# Altium schematic sheet 10_Clock.SchDoc: Clock
size A3; Organization: Lime Microsystems; Address1: Surrey Tech Centre; Address2: Guildford GU2 7YG; Address3: Surrey; Address4: United Kingdom; Revision: v1.0; SheetNumber: 10; SheetTotal: 11
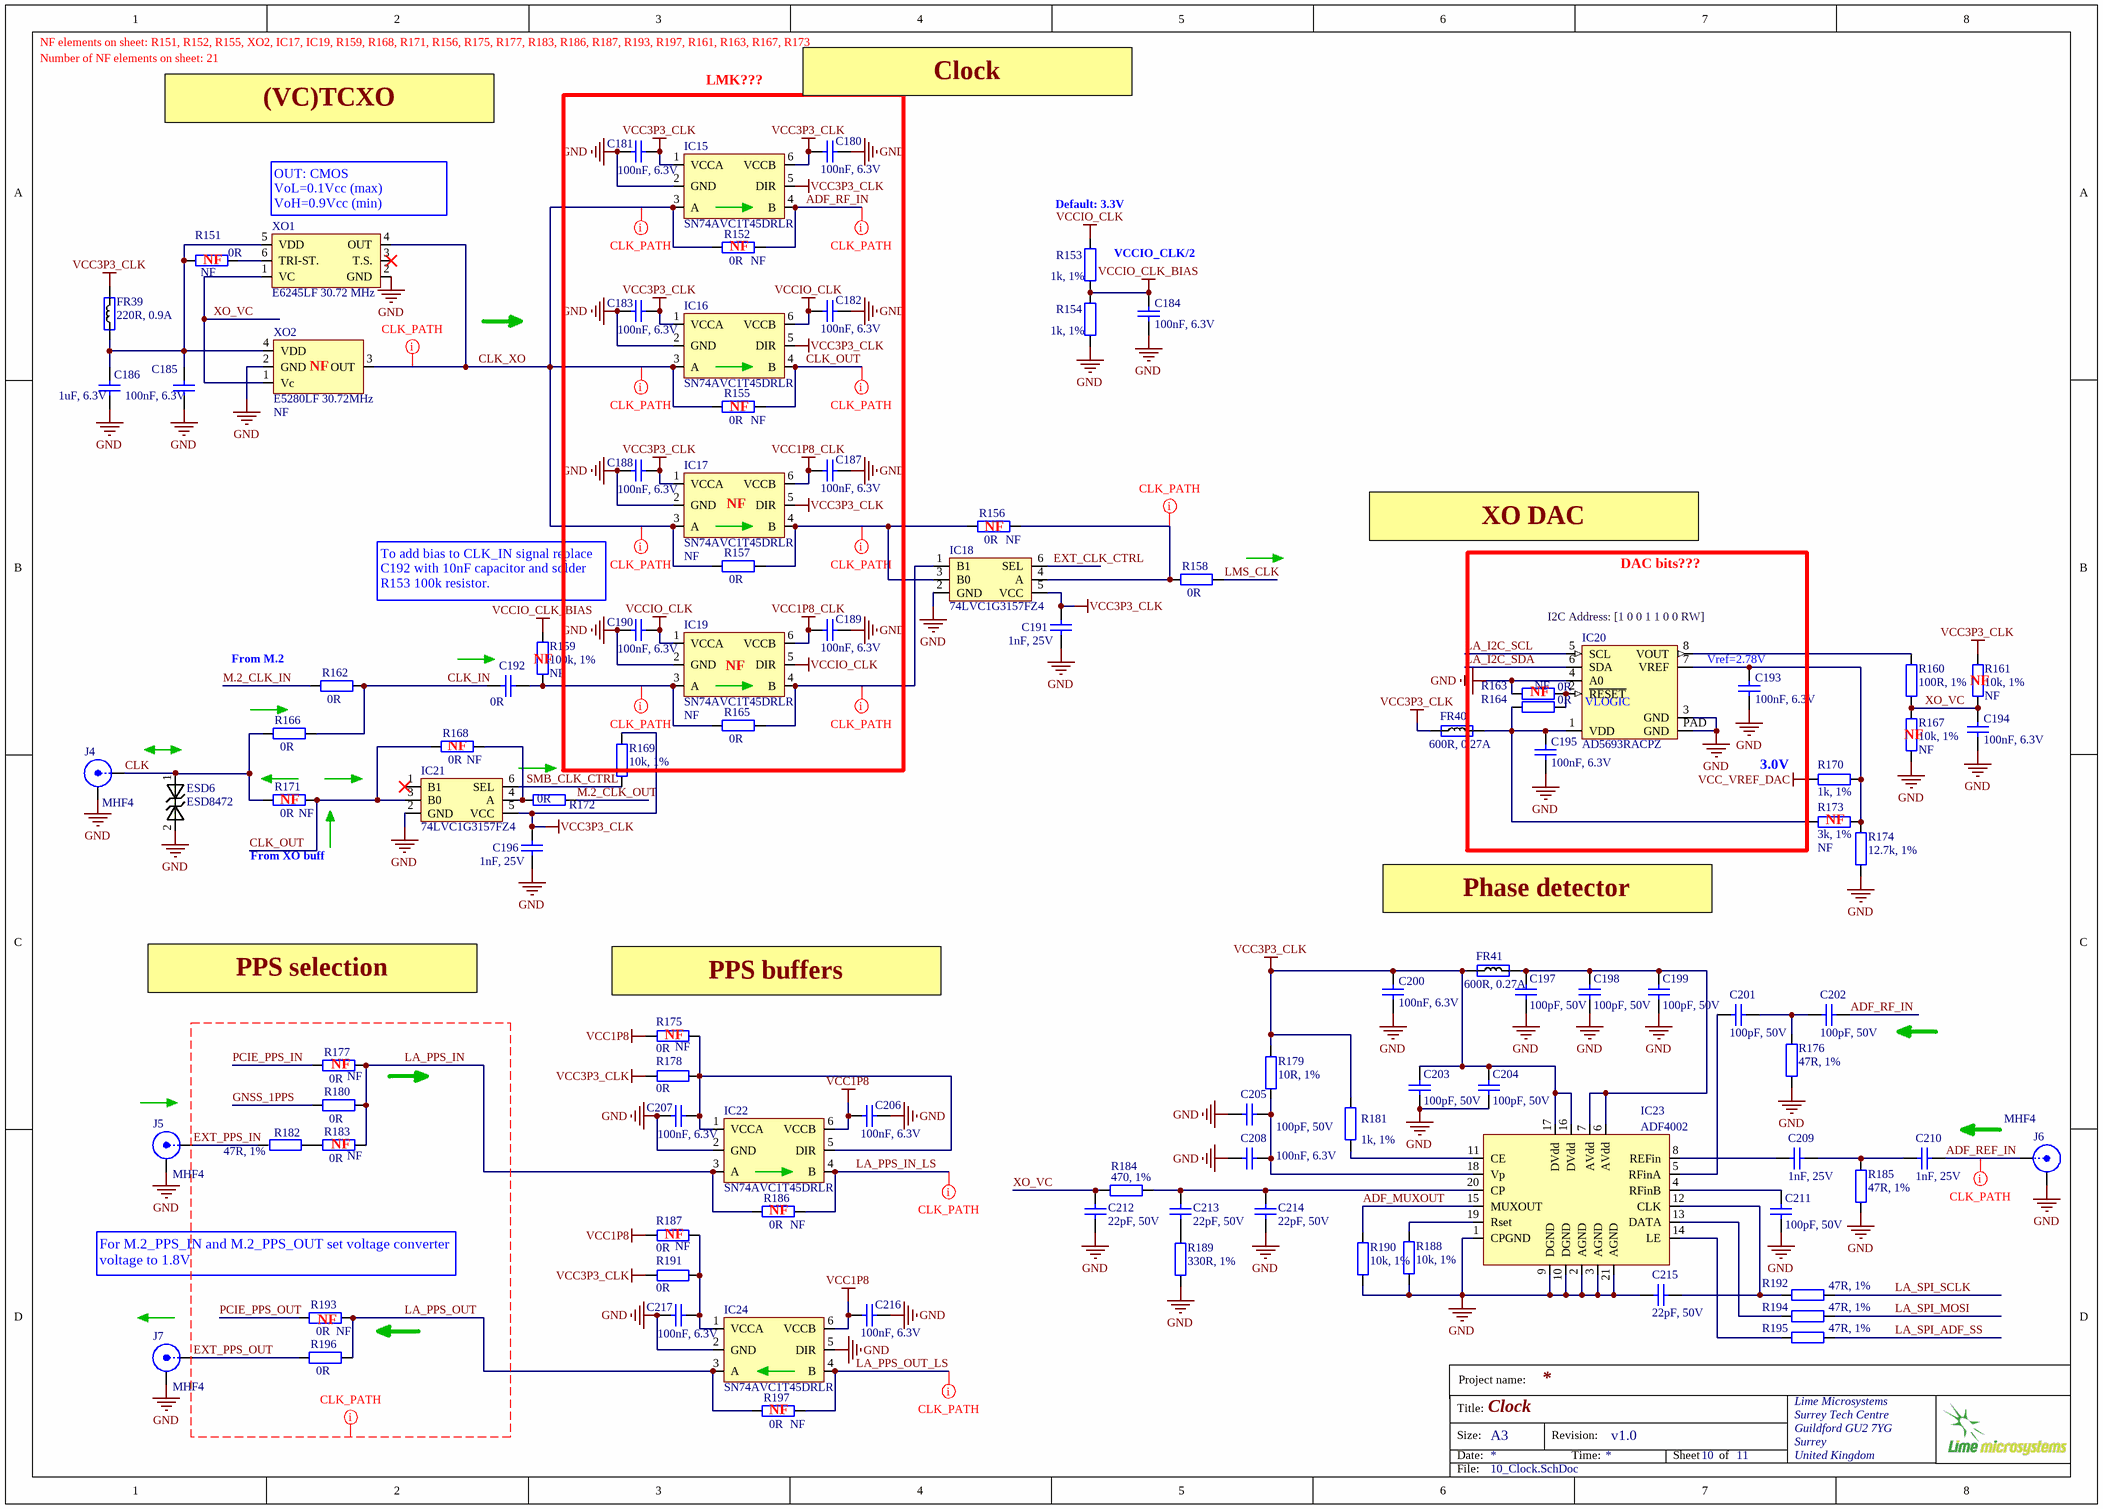
[diagram p0: 10_Clock.SchDoc]

## Parts
C180  100nF, 6.3V  [CAP0201]
C181  100nF, 6.3V  [CAP0201]
C182  100nF, 6.3V  [CAP0201]
C183  100nF, 6.3V  [CAP0201]
C184  100nF, 6.3V  [CAP0201]
C185  100nF, 6.3V  [CAP0201]
C186  1uF, 6.3V  [CAP0201]
C187  100nF, 6.3V  [CAP0201]
C188  100nF, 6.3V  [CAP0201]
C189  100nF, 6.3V  [CAP0201]
C190  100nF, 6.3V  [CAP0201]
C191  1nF, 25V  [CAP0201]
C192  0R  [CAP0201]
C193  100nF, 6.3V  [CAP0201]
C194  100nF, 6.3V  [CAP0201]
C195  100nF, 6.3V  [CAP0201]
C196  1nF, 25V  [CAP0201]
C197  100pF, 50V  [CAP0201]
C198  100pF, 50V  [CAP0201]
C199  100pF, 50V  [CAP0201]
C200  100nF, 6.3V  [CAP0201]
C201  100pF, 50V  [CAP0201]
C202  100pF, 50V  [CAP0201]
C203  100pF, 50V  [CAP0201]
C204  100pF, 50V  [CAP0201]
C205  100pF, 50V  [CAP0201]
C206  100nF, 6.3V  [CAP0201]
C207  100nF, 6.3V  [CAP0201]
C208  100nF, 6.3V  [CAP0201]
C209  1nF, 25V  [CAP0201]
C210  1nF, 25V  [CAP0201]
C211  100pF, 50V  [CAP0201]
C212  22pF, 50V  [CAP0201]
C213  22pF, 50V  [CAP0201]
C214  22pF, 50V  [CAP0201]
C215  22pF, 50V  [CAP0201]
C216  100nF, 6.3V  [CAP0201]
C217  100nF, 6.3V  [CAP0201]
ESD6  ESD8472  [ESD8472_X3DFN2]
FR39  220R, 0.9A  [RES0402]
FR40  600R, 0.27A  [RES0201]
FR41  600R, 0.27A  [RES0201]
IC15  SN74AVC1T45DRLR  [SN74AVC1T45DRLR_SOT-5X3]
IC16  SN74AVC1T45DRLR  [SN74AVC1T45DRLR_SOT-5X3]
IC17  SN74AVC1T45DRLR  Assembly Info: NF  [SN74AVC1T45DRLR_SOT-5X3]
IC18  74LVC1G3157FZ4  [74LVC1G3157FZ4_SPDT_SW_DFN1410-6]
IC19  SN74AVC1T45DRLR  Assembly Info: NF  [SN74AVC1T45DRLR_SOT-5X3]
IC20  AD5693RACPZ  [AD5693RACPZ-1RL7_DAC_8LFCSP]
IC21  74LVC1G3157FZ4  [74LVC1G3157FZ4_SPDT_SW_DFN1410-6]
IC22  SN74AVC1T45DRLR  [SN74AVC1T45DRLR_SOT-5X3]
IC23  ADF4002  [ADF4002]
IC24  SN74AVC1T45DRLR  [SN74AVC1T45DRLR_SOT-5X3]
J4  MHF4  [IPEX_MHF4_conn]
J5  MHF4  [IPEX_MHF4_conn]
J6  MHF4  [IPEX_MHF4_conn]
J7  MHF4  [IPEX_MHF4_conn]
R151  0R  Assembly Info: NF  [RES0402]
R152  0R  Assembly Info: NF  [RES0201]
R153  1k, 1%  [RES0201]
R154  1k, 1%  [RES0201]
R155  0R  Assembly Info: NF  [RES0201]
R156  0R  Assembly Info: NF  [RES0201]
R157  0R  [RES0201]
R158  0R  [RES0201]
R159  100k, 1%  Assembly Info: NF  [RES0201]
R160  100R, 1%  [RES0201]
R161  10k, 1%  Assembly Info: NF  [RES0201]
R162  0R  [RES0201]
R163  0R  Assembly Info: NF  [RES0201]
R164  0R  [RES0201]
R165  0R  [RES0201]
R166  0R  [RES0201]
R167  10k, 1%  Assembly Info: NF  [RES0201]
R168  0R  Assembly Info: NF  [RES0201]
R169  10k, 1%  [RES0201]
R170  1k, 1%  [RES0201]
R171  0R  Assembly Info: NF  [RES0201]
R172  0R  [RES0201]
R173  3k, 1%  Assembly Info: NF  [RES0201]
R174  12.7k, 1%  [RES0201]
R175  0R  Assembly Info: NF  [RES0201]
R176  47R, 1%  [RES0201]
R177  0R  Assembly Info: NF  [RES0201]
R178  0R  [RES0201]
R179  10R, 1%  [RES0201]
R180  0R  [RES0201]
R181  1k, 1%  [RES0201]
R182  47R, 1%  [RES0201]
R183  0R  Assembly Info: NF  [RES0201]
R184  470, 1%  [RES0201]
R185  47R, 1%  [RES0201]
R186  0R  Assembly Info: NF  [RES0201]
R187  0R  Assembly Info: NF  [RES0201]
R188  10k, 1%  [RES0201]
R189  330R, 1%  [RES0201]
R190  10k, 1%  [RES0201]
R191  0R  [RES0201]
R192  47R, 1%  [RES0201]
R193  0R  Assembly Info: NF  [RES0201]
R194  47R, 1%  [RES0201]
R195  47R, 1%  [RES0201]
R196  0R  [RES0201]
R197  0R  Assembly Info: NF  [RES0201]
XO1  E6245LF 30.72 MHz  [RAKON_RPT7050A]
XO2  E5280LF 30.72MHz  Assembly Info: NF  [RAKON_TXCO]

## Nets
GND: C180.2 C181.1 C182.2 C183.1 C184.2 C185.2 C186.2 C187.2 C188.1 C189.2 C190.1 C191.1 C193.2 C194.2 C195.2 C196.1 C197.1 C198.1 C199.1 C200.2 C203.1 C204.1 C205.2 C206.2 C207.1 C208.1 C211.1 C212.1 C214.1 C215.2 C216.2 C217.1 ESD6.2 IC15.2(GND) IC16.2(GND) IC17.2(GND) IC18.2(GND) IC19.2(GND) IC20.3(GND) IC20.4(A0) IC20.PAD(GND) IC21.2(GND) IC22.2(GND) IC23.1(CPGND) IC23.2(AGND) IC23.3(AGND) IC23.9(DGND) IC23.10(DGND) IC23.21(AGND) IC24.2(GND) IC24.5(DIR) J4.2(Y) J5.2(Y) J6.2(Y) J7.2(Y) R154.2 R163.1 R167.2 R174.2 R176.2 R185.1 R188.2 R189.2 R190.2 XO1.2(GND) XO2.2(GND)
VCC1P8: C206.1 C216.1 IC22.6(VCCB) IC24.6(VCCB) R175.2 R187.2
VCC1P8_CLK: C187.1 C189.1 IC17.6(VCCB) IC19.6(VCCB)
VCC3P3_CLK: C180.1 C181.2 C183.2 C188.2 C191.2 C196.2 C200.1 C203.2 C204.2 FR39.2 FR40.1 FR41.1 IC15.1(VCCA) IC15.5(DIR) IC15.6(VCCB) IC16.1(VCCA) IC16.5(DIR) IC17.1(VCCA) IC17.5(DIR) IC18.5(VCC) IC21.5(VCC) IC23.16(DVdd) IC23.17(DVdd) R161.1 R169.2 R178.2 R179.2 R181.1 R191.2
VCC_VREF_DAC: R170.2
VCCIO_CLK: C182.1 C190.2 IC16.6(VCCB) IC19.1(VCCA) IC19.5(DIR) R153.1
VCCIO_CLK_BIAS: C184.1 R153.2 R154.1 R159.1
ADF_MUXOUT: IC23.15(MUXOUT) R190.1
ADF_REF_IN: C210.2 J6.1(X)
ADF_RF_IN: C202.1 IC15.4(B) R152.2
CLK: ESD6.1 J4.1(X) R166.1 R171.1
CLK_IN: C192.1 R162.2 R166.2
CLK_OUT: IC16.4(B) IC21.3(B0) R155.2 R168.1 R171.2
CLK_XO: IC15.3(A) IC16.3(A) IC17.3(A) R152.1 R155.1 R157.1 XO1.4(OUT) XO2.3(OUT)
EXT_CLK_CTRL: IC18.6(SEL)
EXT_PPS_IN: J5.1(X) R182.2
EXT_PPS_OUT: J7.1(X) R196.1
GNSS_1PPS: R180.1
LA_I2C_SCL: IC20.5(SCL)
LA_I2C_SDA: IC20.6(SDA)
LA_PPS_IN: IC22.3(A) R177.2 R180.2 R183.2 R186.1
LA_PPS_IN_LS: IC22.4(B) R186.2
LA_PPS_OUT: IC24.3(A) R193.2 R196.2 R197.1
LA_PPS_OUT_LS: IC24.4(B) R197.2
LA_SPI_ADF_SS: R195.2
LA_SPI_MOSI: R194.2
LA_SPI_SCLK: R192.2
LMS_CLK: R158.2
M.2_CLK_IN: R162.1
M.2_CLK_OUT: R172.2
PCIE_PPS_IN: R177.1
PCIE_PPS_OUT: R193.1
SMB_CLK_CTRL: IC21.6(SEL) R169.1
XO_VC: C194.1 C212.2 R160.2 R161.2 R167.1 R184.1 XO1.1(VC) XO2.1(Vc)
NetC185_1: C185.1 C186.1 FR39.1 R151.2 XO1.5(VDD) XO2.4(VDD)
NetC192_2: C192.2 IC19.3(A) R159.2 R165.1
NetC193_1: C193.1 IC20.7(VREF) R170.1 R173.1 R174.1
NetC195_1: C195.1 FR40.2 IC20.1(VDD) R164.1 R173.2
NetC197_2: C197.2 C198.2 C199.2 FR41.2 IC23.6(AVdd) IC23.7(AVdd)
NetC201_1: C201.1 C202.2 R176.1
NetC201_2: C201.2 IC23.5(RFinA)
NetC205_1: C205.1 C208.2 IC23.18(Vp) R179.1
NetC207_2: C207.2 IC22.1(VCCA) IC22.5(DIR) R175.1 R178.1
NetC209_1: C209.1 IC23.8(REFin)
NetC209_2: C209.2 C210.1 R185.2
NetC211_2: C211.2 IC23.4(RFinB)
NetC213_1: C213.1 R189.1
NetC213_2: C213.2 C214.2 IC23.20(CP) R184.2
NetC215_1: C215.1 IC23.12(CLK) R192.1
NetC217_2: C217.2 IC24.1(VCCA) R187.1 R191.1
NetIC17_4: IC17.4(B) IC18.3(B0) R156.1 R157.2
NetIC18_1: IC18.1(B1) IC19.4(B) R165.2
NetIC18_4: IC18.4(A) R156.2 R158.1
NetIC20_2: IC20.2(~{RESET}) R163.2 R164.2
NetIC20_8: IC20.8(VOUT) R160.1
NetIC21_4: IC21.4(A) R168.2 R172.1
NetIC23_11: IC23.11(CE) R181.2
NetIC23_13: IC23.13(DATA) R194.1
NetIC23_14: IC23.14(LE) R195.1
NetIC23_19: IC23.19(Rset) R188.1
NetR151_1: R151.1 XO1.6(TRI-ST.)
NetR182_1: R182.1 R183.1

Not connected (* = marked no-connect by the designer): IC21 1(B1)*; XO1 3(T.S.)*

## Layout directives
net class CLK_PATH: ADF_REF_IN, ADF_RF_IN, CLK_OUT, CLK_XO, EXT_PPS_IN, EXT_PPS_OUT, GNSS_1PPS, LA_PPS_IN, LA_PPS_IN_LS, LA_PPS_OUT, LA_PPS_OUT_LS, NetC192_2, NetIC17_4, NetIC18_1, NetIC18_4, PCIE_PPS_IN, PCIE_PPS_OUT

## Notes on the sheet
- NF elements on sheet: R151, R152, R155, XO2, IC17, IC19, R159, R168, R171, R156, R175, R177, R183, R186, R187, R193, R197, R161, R163, R167, R173
- Number of NF elements on sheet: 21
- LMK???
- Clock
- (VC)TCXO
- (near XO1) OUT: CMOS
  VoL=0.1Vcc (max)
  VoH=0.9Vcc (min)
- (near R152) NF
- (near R153) Default: 3.3V
- (near R151) NF
- (near R153) VCCIO_CLK/2
- (near XO2) NF
- (near R155) NF
- (near IC17) NF
- (near R156) NF
- XO DAC
- DAC bits???
- To add bias to CLK_IN signal replace C192 with 10nF capacitor and solder R153 100k resistor.
- (near IC20) I2C Address: [1 0 0 1 1 0 0 RW]
- From M.2
- (near R159) NF
- (near IC19) NF
- (near R163) NF
- (near IC20) VLOGIC
- (near C193) Vref=2.78V
- (near R161) NF
- (near R168) NF
- (near R170) 3.0V
- (near R167) NF
- (near R171) NF
- (near R173) NF
- (near R171) From XO buff
- Phase detector
- PPS selection
- (near R175) PPS buffers
- (near R175) NF
- (near R177) NF
- (near R183) NF
- (near R187) NF
- (near R186) NF
- (near R193) For M.2_PPS_IN and M.2_PPS_OUT set voltage converter voltage to 1.8V
- (near R193) NF
- (near R197) NF
- Project name:
- Title:
- Size:
- Date:
- A3
- Revision:
- Time:
- Sheet
- of
- File:

## Library data of the parts
C180-C185 C187-C190 C193-C195 C200 C206-C208 C216 C217 = Cap_0402: Part Description: 0.1 µF ±20% 10V Ceramic Capacitor X5R 0201 (0603 Metric); Manufacturer: Samsung; Manufacturer Part Number 1: CL03A104MP3NNNC; Tolerance: 20%; Voltage Rating (DC): 10V; Value: 100nF, 6.3V; Capacitance: 100nF; Case/Package: 0201; Case Code (Imperial): 0201; Case Code (Metric): 0603; ComponentLink5Description: https://datasheet.ciiva.com/25788/cl03a104mp3nnnc-25788272.pdf?src-supplier=Digi-Key; ComponentLink5URL: https://datasheet.ciiva.com/25788/cl03a104mp3nnnc-25788272.pdf?src-supplier=Digi-Key; Length: 0.024inch; Max Operating Temperature: 85°C; Min Operating Temperature: -55°C; Mount: Surface Mount; Package Quantity: 1; Packaging: Tape and Reel; Pricing 1: 1=0,10000, 10=0,03000, 50=0,01640, 100=0,01330, 500=0,00950, 1000=0,00747, 2500=0,00679, 5000=0,00625 (USD); RoHS: Yes; RoHS Compliant: Yes; Series: CL; Stock 1: 3817176; Supplier 1: Digi-Key; Supplier Part Number 1: 1276-1321-1-ND; Thickness: 0.013inch; Voltage Rating: 10V; Width: 0.012inch
C186 = Cap_0402: Manufacturer: TDK Corporation; Manufacturer Part Number 1: JMK063ABJ105MP-F; Part Description: 1µF ±20% 6.3V X5R Ceramic Capacitor -55°C ~ 85°C Surface Mount, MLCC 0201 (0603 Metric) 0.024" L x 0.012" W (0.60mm x 0.30mm); Value: 1uF, 20%; Tolerance: ±20%; Capacitance: 1.0µF; Temperature Coefficient: X5R; Supplier 1: Digi-Key; Supplier Part Number 1: 587-5864-2-ND; Applications: General Purpose; Features: -; Lead Style: -; Ratings: -; Thickness (Max): -; Lead Spacing: -; Height - Seated (Max): -; Size / Dimension: 0.024" L x 0.012" W (0.60mm x 0.30mm); Mounting Type: Surface Mount, MLCC; Operating Temperature: -55°C ~ 85°C; Package / Case: 0201 (0603 Metric); Packaging: Cut Tape (CT); Voltage - Rated: 6.3V; Category: Capacitors; RoHS: RoHS Compliant
C191 C196 C209 C210 = Cap_0402: Manufacturer Part Number 1: C0603X7R1E102K030BA; Manufacturer: TDK Corporation; Part Description: 1000pF ±10% 25V X7R Ceramic Capacitor -55°C ~ 125°C Surface Mount, MLCC 0201 (0603 Metric) 0.024" L x 0.012" W (0.60mm x 0.30mm); Temperature Coefficient: X7R; Tolerance: ±10%; Capacitance: 1000pF; Value: 1nF, 25V; Supplier 1: Digi-Key; Supplier Part Number 1: 445-7275-1-ND; Voltage - Rated: 25V; Features: -; Package / Case: 0201 (0603 Metric); Lead Spacing: -; Mounting Type: Surface Mount, MLCC; Lead Style: -; Height - Seated (Max): -; Operating Temperature: -55°C ~ 125°C; Size / Dimension: 0.024" L x 0.012" W (0.60mm x 0.30mm); Applications: General Purpose; Ratings: -; Thickness (Max): 0.013" (0.33mm); RoHS: RoHS Compliant; Packaging: Cut Tape (CT); Category: Capacitors
C192 = Cap_0402: Manufacturer: Yageo; Manufacturer Part Number 1: RC0201JR-070RL; Part Description: 0 Ohms Jumper Chip Resistor 0201 (0603 Metric) Moisture Resistant Thick Film; Max Power Dissipation: 50mW; Resistance Tolerance: 5%; Voltage Rating (DC): 25V; Case/Package: 0201; Case Code (Imperial): 0201; Case Code (Metric): 0603; ComponentLink1Description: http://www.yageo.com/documents/recent/PYu-RC_Group_51_RoHS_L_7.pdf; ComponentLink1URL: http://www.yageo.com/documents/recent/PYu-RC_Group_51_RoHS_L_7.pdf; ComponentLink2Description: https://datasheet.ciiva.com/7672/1563626-7672248.pdf?src-supplier=Element14; ComponentLink2URL: https://datasheet.ciiva.com/7672/1563626-7672248.pdf?src-supplier=Element14; ComponentLink3Description: https://datasheet.ciiva.com/7672/1563626-7672247.pdf?src-supplier=Element14; ComponentLink3URL: https://datasheet.ciiva.com/7672/1563626-7672247.pdf?src-supplier=Element14; ComponentLink4Description: https://datasheet.ciiva.com/7660/1421516-7660808.pdf?src-supplier=Element14; ComponentLink4URL: https://datasheet.ciiva.com/7660/1421516-7660808.pdf?src-supplier=Element14; ComponentLink5Description: https://datasheet.ciiva.com/46391/1421516-46391340.pdf?src-supplier=Element14; ComponentLink5URL: https://datasheet.ciiva.com/46391/1421516-46391340.pdf?src-supplier=Element14; Construction: Rectangular; Contact Plating: Tin,Matte; Depth: 0.3mm; Features: Moisture Resistant; Height: 0.01inch; Lead Free: Lead Free; Length: 0.024inch; Max Operating Temperature: 125°C; Military Standard: Not; Min Operating Temperature: -55°C; Number of Terminations: 2; Package Quantity: 1; Packaging: Tape and Reel; Power Rating: 50mW; Pricing 1: 1=0,10000, 10=0,03700, 25=0,02680, 50=0,02020, 100=0,01500, 250=0,01140, 500=0,00912, 1000=0,00672, 5000=0,00482 (USD); Radiation Hardening: No; Resistance: 0R; Resistor Type: Thick Film; RoHS: Yes; RoHS Compliant: Yes; Series: RC; Size Code: 0201; Stock 1: 6252381; Supplier 1: Digi-Key; Supplier Part Number 1: 311-0.0NCT-ND; Termination: SMD/SMT; Tolerance: 5%; Value: 0R; Voltage Rating: 25V; Weight: 6E-06oz; Width: 0.012inch
C197-C199 C201-C205 C211 = Cap_0402: Part Description: 100 pF ±5% 50V Ceramic Capacitor C0G, NP0 0201 (0603 Metric); Manufacturer: TDK; Manufacturer Part Number 1: C0603C0G1H101J030BA; Dielectric: C0G; Dielectric Material: Ceramic; Insulation Resistance: 10GR; Tolerance: 5%; Value: 100pF, 50V; Capacitance: 100pF; Case/Package: 0201; Case Code (Imperial): 0201; Case Code (Metric): 0603; ComponentLink1Description: https://datasheet.ciiva.com/24217/c0603c0g1h101j030ba-264106-24217425.pdf?src-supplier=Mouser; ComponentLink1URL: https://datasheet.ciiva.com/24217/c0603c0g1h101j030ba-264106-24217425.pdf?src-supplier=Mouser; ComponentLink2Description: https://datasheet.ciiva.com/16205/mlcc-commercial-general-en-16205590.pdf?src-supplier=Future+Electronics; ComponentLink2URL: https://datasheet.ciiva.com/16205/mlcc-commercial-general-en-16205590.pdf?src-supplier=Future+Electronics; ComponentLink3Description: https://datasheet.ciiva.com/6250/tdkmlcccaprange-6250351.pdf?src-supplier=Digi-Key; ComponentLink3URL: https://datasheet.ciiva.com/6250/tdkmlcccaprange-6250351.pdf?src-supplier=Digi-Key; Construction: Flat; Depth: 0.3mm; Height: 0.3mm; Lead Free: Lead Free; Length: 0.6mm; Max Operating Temperature: 125°C; Min Operating Temperature: -55°C; Mount: Surface Mount; Number of Pins: 2; Package Quantity: 1; Packaging: Tape and Reel; Pricing 1: 1=0,10000, 10=0,06000, 50=0,03280, 100=0,02670, 500=0,01908, 1000=0,01500, 2500=0,01364, 5000=0,01254 (USD); Reach SVHC Compliant: Yes; RoHS: Yes; RoHS Compliant: Yes; Series: C; Stock 1: 367528; Supplier 1: Digi-Key; Supplier Part Number 1: 445-1786-1-ND; Termination: SMD/SMT; Thickness: 0.013inch; Voltage: 50V; Voltage Rating (DC): 50V; Voltage Rating: 50V; Weight: 6E-06oz; Width: 0.012inch
C212-C215 = Cap_0402: Manufacturer: Murata; Manufacturer Part Number 1: GRM0335C1H220JA01D; Part Description: 22 pF ±5% 50V Ceramic Capacitor C0G, NP0 0201 (0603 Metric); Tolerance: 5%; Dielectric: C0G; Value: 22pF, 50V; Supplier 1: Digi-Key; Supplier Part Number 1: 490-6123-1-ND; Stock 1: 2966748; Pricing 1: 1=0,10000, 10=0,01300, 50=0,00720, 100=0,00590, 500=0,00424, 1000=0,00333, 2500=0,00303, 5000=0,00279 (USD); RoHS: Yes; Mount: Surface Mount; Case/Package: 0201; Case Code (Metric): 0603; Case Code (Imperial): 0201; Min Operating Temperature: -55°C; Max Operating Temperature: 125°C; Package Quantity: 15000; Capacitance: 22pF; Voltage Rating: 50V; Packaging: Tape and Reel; Termination: SMD/SMT; Voltage: 50V; Voltage Rating (DC): 50V; Series: GRM; Length: 0.6mm; Width: 0.012inch; Height: 0.3mm; Thickness: 0.013inch; Depth: 0.3mm; Lead Free: Lead Free; RoHS Compliant: Yes; ComponentLink1URL: https://datasheet.ciiva.com/6271/partnumbering-e-01-6271146.pdf?src-supplier=Digi-Key; ComponentLink1Description: https://datasheet.ciiva.com/6271/partnumbering-e-01-6271146.pdf?src-supplier=Digi-Key; ComponentLink2URL: https://datasheet.ciiva.com/6271/partnumbering-e-01-6271143.pdf?src-supplier=Digi-Key; ComponentLink2Description: https://datasheet.ciiva.com/6271/partnumbering-e-01-6271143.pdf?src-supplier=Digi-Key; ComponentLink3URL: https://datasheet.ciiva.com/6271/partnumbering-e-01-6271149.pdf?src-supplier=Digi-Key; ComponentLink3Description: https://datasheet.ciiva.com/6271/partnumbering-e-01-6271149.pdf?src-supplier=Digi-Key
ESD6 = ESD8472: Manufacturer: ON Semiconductor; Manufacturer Part Number 1: ESD8472MUT5G; Part Description: TVS DIODE 5.3VWM 14VC X3DFN2; Voltage - Reverse Standoff (Typ): 5.3V (Max); Voltage - Breakdown (Min): 7V; Voltage - Clamping (Max) @ Ipp: 14V; Current - Peak Pulse (10/1000µs): 3A (8/20µs); Power Line Protection: No; Capacitance @ Frequency: 0.2pF @ 1MHz; Supplier 1: Digi-Key; RoHS: RoHS Compliant; Category: Circuit Protection; Stock 1: 2295; Pricing 1: 1=0.39, 10=0.315, 100=0.2142, 500=0.16068, 1000=0.12051 (USD); Packaging: Cut Tape (CT); Part Status: Active; Type: Zener; Power - Peak Pulse: -; Applications: Automotive, RF Antenna; Operating Temperature: -55°C ~ 150°C (TJ); Mounting Type: Surface Mount; Package / Case: 2-XFDFN; Supplier Device Package: 2-X3DFN (0.62x0.32); ComponentLink1URL: http://www.onsemi.com/pub/Collateral/ESD8472-D.PDF; ComponentLink1Description: http://www.onsemi.com/pub/Collateral/ESD8472-D.PDF; Supplier Part Number 1: ESD8472MUT5GOSCT-ND
FR39 = Ferrite: Manufacturer: TDK Corporation; Manufacturer Part Number 1: MPZ1005S221ET000; Part Description: FERRITE BEAD 220 OHM 0402 1LN; Impedance @ Frequency: 220 Ohm @ 100MHz; Current Rating: 900mA; DC Resistance (DCR): 220 mOhm Max; Supplier 1: Digi-Key; Package / Case: 0402 (1005 Metric); Category: Filters; Supplier Part Number 1: 445-9329-2-ND; Value: 220R, 0.9A
FR40 FR41 = Ferrite: Manufacturer Part Number 1: BK0603TS601-T; Manufacturer: Taiyo Yuden; Part Description: FERRITE BEAD 600 OHM 0201 1LN; DC Resistance (DCR): 750 mOhm Max; Filter Type: Differential Mode - Single; Impedance @ Frequency: 600 Ohm @ 100MHz; Current Rating: 270mA; Value: 600R@100MHz; Supplier 1: Digi-Key; Supplier Part Number 1: 587-3277-1-ND; Size / Dimension: 0.024" L x 0.012" W (0.60mm x 0.30mm); Package / Case: 0201 (0603 Metric); Height (Max): 0.013" (0.33mm); Mounting Type: Surface Mount; Packaging: Cut Tape (CT); RoHS: RoHS Compliant; Category: Filters
IC15-IC17 IC19 IC22 IC24 = SN74AVC1T45DRLR_lvl_translator: Part Description: Voltage Level Translator Bidirectional 1 Circuit 1 Channel 500Mbps SOT-5X3; Manufacturer: Texas Instruments; Supplier 1: Digi-Key; Supplier Part Number 1: 296-21022-1-ND; Manufacturer Part Number 1: SN74AVC1T45DRLR; Stock 1: 46610; Pricing 1: 1=0,68, 10=0,6, 25=0,5636, 100=0,46, 250=0,42724, 500=0,3636, 1000=0,29088 (USD); RoHS: Yes; Length: 1.6mm; Width: 1.2mm; Height: 600um; Thickness: 550um; ComponentLink1URL: https://datasheet.ciiva.com/1629/sn74avc1t45-1629536.pdf?src-supplier=Newark; ComponentLink1Description: https://datasheet.ciiva.com/1629/sn74avc1t45-1629536.pdf?src-supplier=Newark; ComponentLink2URL: https://datasheet.ciiva.com/15086/getdatasheetpartid-223729-15086386.pdf?src-supplier=Verical; ComponentLink2Description: https://datasheet.ciiva.com/15086/getdatasheetpartid-223729-15086386.pdf?src-supplier=Verical; ComponentLink3URL: https://datasheet.ciiva.com/14287/sn74avc1t45-14287328.pdf?src-supplier=Avnet; ComponentLink3Description: https://datasheet.ciiva.com/14287/sn74avc1t45-14287328.pdf?src-supplier=Avnet; ComponentLink4URL: https://datasheet.ciiva.com/22729/1862374-22729941.pdf?src-supplier=Element14; ComponentLink4Description: https://datasheet.ciiva.com/22729/1862374-22729941.pdf?src-supplier=Element14; ComponentLink5URL: https://datasheet.ciiva.com/46385/1887534-46385799.pdf?src-supplier=Element14; ComponentLink5Description: https://datasheet.ciiva.com/46385/1887534-46385799.pdf?src-supplier=Element14; ComponentLink6URL: https://datasheet.ciiva.com/14287/sn74avc1t45-14287479.pdf?src-supplier=Avnet; ComponentLink6Description: https://datasheet.ciiva.com/14287/sn74avc1t45-14287479.pdf?src-supplier=Avnet; ComponentLink7URL: https://datasheet.ciiva.com/1899/sn74avc1t45-1899278.pdf?src-supplier=Digi-Key; ComponentLink7Description: https://datasheet.ciiva.com/1899/sn74avc1t45-1899278.pdf?src-supplier=Digi-Key; ComponentLink8URL: https://datasheet.ciiva.com/1899/sn74avc1t45-1899279.pdf?src-supplier=Digi-Key; ComponentLink8Description: https://datasheet.ciiva.com/1899/sn74avc1t45-1899279.pdf?src-supplier=Digi-Key; ComponentLink9URL: https://datasheet.ciiva.com/1899/sn74avc1t45-1899280.pdf?src-supplier=Digi-Key; ComponentLink9Description: https://datasheet.ciiva.com/1899/sn74avc1t45-1899280.pdf?src-supplier=Digi-Key
IC18 IC21 = 74LVC1G3157FZ4_SPDT_SW: Part Description: 1 Circuit IC Switch 2:1 10Ohm X2-DFN1410-6; Manufacturer: Diodes; Manufacturer Part Number 1: 74LVC1G3157FZ4-7; Number of Circuits: 1; On-State Resistance: 10R; -3db Bandwidth: 300MHz; Supplier 1: Digi-Key; Supplier Part Number 1: 74LVC1G3157FZ4-7DICT-ND; Stock 1: 158709; Pricing 1: 1=0,42000, 10=0,31200, 25=0,27320, 100=0,17670, 250=0,14628, 500=0,11702, 1000=0,08972, 2500=0,07802 (USD); RoHS: Yes; Number of Pins: 6; Min Operating Temperature: -40°C; Max Operating Temperature: 125°C; Packaging: Tape and Reel; RoHS Compliant: Yes; ComponentLink1URL: https://www.diodes.com/assets/Datasheets/74LVC1G3157.pdf?src-supplier=Digi-Key; ComponentLink1Description: https://www.diodes.com/assets/Datasheets/74LVC1G3157.pdf?src-supplier=Digi-Key; ComponentLink2URL: https://www.diodes.com/assets/product-showcases/74LVC3157-NPA-0516.pdf?src-supplier=Digi-Key; ComponentLink2Description: https://www.diodes.com/assets/product-showcases/74LVC3157-NPA-0516.pdf?src-supplier=Digi-Key
IC20 = AD5693RACPZ-1RL7_DAC: Part Description: Digital to Analog Converters - DAC 16-BIT 12C nanoDAC+ with on-chip ref; Manufacturer: Analog Devices; Number of DAC Channels: 1; Resolution: 16b; Settling Time: 5us; Integral Nonlinearity (INL): 8LSB; Polarity: Unipolar; Signal to Noise Ratio (SNR): 90dB; Max Supply Voltage: 5.5V; Min Output Voltage: 0uV; Slew Rate: 0.7V/µs; Output Type: Voltage; Supplier 1: Mouser; Supplier Part Number 1: 584-AD5693RACPZ-1RL7; Manufacturer Part Number 1: AD5693RACPZ-1RL7; Stock 1: 4949; Pricing 1: 1=8,56000, 10=7,73000, 50=7,36000, 100=6,40000, 1000=5,08000, 10000=5,08000 (USD); RoHS: Yes; Mount: Surface Mount; Number of Pins: 8; Min Operating Temperature: -40°C; Max Operating Temperature: 105°C; Max Input Voltage: 5.5V; Max Output Voltage: 5.5V; Lead Free: Contains Lead; RoHS Compliant: Yes; ComponentLink1URL: http://www.mouser.com/ds/2/609/AD5693R_5692R_5691R_5693-534178.pdf?src-supplier=Mouser; ComponentLink1Description: http://www.mouser.com/ds/2/609/AD5693R_5692R_5691R_5693-534178.pdf?src-supplier=Mouser; ComponentLink2URL: https://www.analog.com/media/en/technical-documentation/data-sheets/AD5693R_5692R_5691R_5693.pdf?src-supplier=Digi-Key; ComponentLink2Description: https://www.analog.com/media/en/technical-documentation/data-sheets/AD5693R_5692R_5691R_5693.pdf?src-supplier=Digi-Key; ComponentLink3URL: http://www.analog.com/static/imported-files/data_sheets/AD5693R_5692R_5691R.pdf?src-supplier=Avnet; ComponentLink3Description: http://www.analog.com/static/imported-files/data_sheets/AD5693R_5692R_5691R.pdf?src-supplier=Avnet; ComponentLink4URL: http://www.analog.com/media/en/technical-documentation/data-sheets/AD5693R_5692R_5691R_5693.pdf?src-supplier=Digi-Key; ComponentLink4Description: http://www.analog.com/media/en/technical-documentation/data-sheets/AD5693R_5692R_5691R_5693.pdf?src-supplier=Digi-Key
IC23 = ADF4002: Manufacturer: Analog Devices Inc; Manufacturer Part Number 1: ADF4002BCPZ-RL7; Part Description: IC PLL FREQUENCY SYNTH 20-LFCSP; Ratio - Input:Output: 2:1; Differential - Input:Output: Yes/No; Input: CMOS, TTL; Voltage - Supply: 2.7 V ~ 3.3 V; Supplier 1: Digi-Key; Supplier: Digi-Key; Category: Integrated Circuits (ICs); Type: Clock/Frequency Synthesizer (RF), Phase Detector; Operating Temperature: -40°C ~ 85°C; Mounting Type: Surface Mount; Package / Case: 20-VFQFN Exposed Pad, CSP; Supplier Part Number 1: ADF4002BCPZ-RL7CT-ND
J4-J7 = RF_IF_connector: IPEX MHF4 Connector Jack, Male Pin 50 Ohms Surface Mount Solder; Manufacturer: TE Connectivity / Linx Technologies; Manufacturer Part Number 1: CONMHF4-SMD-G-T; Part Description: IPEX MHF4 Connector Jack, Male Pin 50 Ohms Surface Mount Solder; Pricing 1: 1=0,22 (USD); RoHS: No; Stock 1: 15668; Supplier 1: Digikey; Supplier Part Number 1: 343-CONMHF4-SMD-G-TCT-ND
R151 = Res_0402: Manufacturer Part Number 1: RC0402JR-070RL; Manufacturer: Yageo; Part Description: RES SMD 0.0OHM JUMPER 1/16W 0402; Resistance (Ohms): 0.0; Tolerance: Jumper; Power (Watts): 0.063W, 1/16W; Value: 0R; Supplier 1: Digi-Key; Supplier Part Number 1: 311-0.0JRTR-ND; Category: Resistors; Temperature Coefficient: -; Features: Moisture Resistant; Supplier Device Package: 0402; Height: 0.016" (0.40mm); Package / Case: 0402 (1005 Metric); Operating Temperature: -55°C ~ 155°C; Size / Dimension: 0.039" L x 0.020" W (1.00mm x 0.50mm); Composition: Thick Film; Packaging: Tape & Reel (TR); Number of Terminations: 2; RoHS: RoHS Compliant
R152 R155-R158 R162-R166 R168 R171 R172 R175 R177 R178 R180 R183 R186 R187 R191 R193 R196 R197 = Res_0402: Part Description: 0 Ohms Jumper Chip Resistor 0201 (0603 Metric) Moisture Resistant Thick Film; Manufacturer: Yageo; Manufacturer Part Number 1: RC0201JR-070RL; Power Rating: 50mW; Tolerance: 5%; Voltage Rating: 25V; ComponentLink1URL: http://www.yageo.com/documents/recent/PYu-RC_Group_51_RoHS_L_7.pdf; ComponentLink1Description: http://www.yageo.com/documents/recent/PYu-RC_Group_51_RoHS_L_7.pdf; Value: 0R; Supplier 1: Digi-Key; Supplier Part Number 1: 311-0.0NCT-ND; Stock 1: 6252381; Pricing 1: 1=0,10000, 10=0,03700, 25=0,02680, 50=0,02020, 100=0,01500, 250=0,01140, 500=0,00912, 1000=0,00672, 5000=0,00482 (USD); RoHS: Yes; Case/Package: 0201; Case Code (Metric): 0603; Case Code (Imperial): 0201; Weight: 6E-06oz; Contact Plating: Tin,Matte; Size Code: 0201; Min Operating Temperature: -55°C; Max Operating Temperature: 125°C; Packaging: Tape and Reel; Resistance: 0R; Package Quantity: 1; Resistor Type: Thick Film; Number of Terminations: 2; Termination: SMD/SMT; Max Power Dissipation: 50mW; Voltage Rating (DC): 25V; Features: Moisture Resistant; Series: RC; Construction: Rectangular; Resistance Tolerance: 5%; Length: 0.024inch; Width: 0.012inch; Height: 0.01inch; Depth: 0.3mm; Radiation Hardening: No; Military Standard: Not; Lead Free: Lead Free; RoHS Compliant: Yes; ComponentLink2URL: https://datasheet.ciiva.com/7672/1563626-7672248.pdf?src-supplier=Element14; ComponentLink2Description: https://datasheet.ciiva.com/7672/1563626-7672248.pdf?src-supplier=Element14; ComponentLink3URL: https://datasheet.ciiva.com/7672/1563626-7672247.pdf?src-supplier=Element14; ComponentLink3Description: https://datasheet.ciiva.com/7672/1563626-7672247.pdf?src-supplier=Element14; ComponentLink4URL: https://datasheet.ciiva.com/7660/1421516-7660808.pdf?src-supplier=Element14; ComponentLink4Description: https://datasheet.ciiva.com/7660/1421516-7660808.pdf?src-supplier=Element14; ComponentLink5URL: https://datasheet.ciiva.com/46391/1421516-46391340.pdf?src-supplier=Element14; ComponentLink5Description: https://datasheet.ciiva.com/46391/1421516-46391340.pdf?src-supplier=Element14
R153 R154 R170 R181 = Res_0402: Manufacturer: Yageo; Manufacturer Part Number 1: RC0201FR-071KL; Part Description: 1 kOhms ±1% 0.05W, 1/20W Chip Resistor 0201 (0603 Metric) Moisture Resistant Thick Film; Resistance: 1kR; Power Rating: 50mW; Voltage Rating: 25V; Temperature Coefficient: 200ppm/°C; Value: 1k, 1%; Supplier 1: Digi-Key; Supplier Part Number 1: 311-1KMDKR-ND; Stock 1: 9099863; Pricing 1: 1=0,10000, 10=0,03700, 100=0,01530, 1000=0,00685, 2500=0,00595, 5000=0,00491 (USD); RoHS: Yes; Case/Package: 0201; Case Code (Metric): 0603; Case Code (Imperial): 0201; Contact Plating: Tin,Matte; Min Operating Temperature: -55°C; Max Operating Temperature: 125°C; Package Quantity: 10000; Packaging: Tape and Reel; Tolerance: 1%; Resistor Type: Thick Film; Number of Terminations: 2; Termination: SMD/SMT; Max Power Dissipation: 50mW; Working Voltage: 25V; Features: Moisture Resistant; Series: RC; Resistance Tolerance: 1%; Technology: THICK FILM; Construction: Rectangular; Length: 0.024inch; Width: 0.012inch; Height: 0.01inch; Depth: 0.3mm; Radiation Hardening: No; Military Standard: Not; Lead Free: Lead Free; RoHS Compliant: Yes; ComponentLink1URL: https://datasheet.ciiva.com/7672/1563626-7672204.pdf?src-supplier=Element14; ComponentLink1Description: https://datasheet.ciiva.com/7672/1563626-7672204.pdf?src-supplier=Element14; ComponentLink2URL: https://datasheet.ciiva.com/22698/1563626-22698505.pdf?src-supplier=Element14; ComponentLink2Description: https://datasheet.ciiva.com/22698/1563626-22698505.pdf?src-supplier=Element14; ComponentLink3URL: https://datasheet.ciiva.com/29721/pyu-r-int-thick-7-29721196.pdf?src-supplier=Digi-Key; ComponentLink3Description: https://datasheet.ciiva.com/29721/pyu-r-int-thick-7-29721196.pdf?src-supplier=Digi-Key; ComponentLink4URL: https://datasheet.ciiva.com/29721/pyu-r-int-thick-7-29721195.pdf?src-supplier=Digi-Key; ComponentLink4Description: https://datasheet.ciiva.com/29721/pyu-r-int-thick-7-29721195.pdf?src-supplier=Digi-Key; ComponentLink5URL: https://datasheet.ciiva.com/8896/pyu-rc0201-51-rohs-l-8-8896174.pdf?src-supplier=Avnet; ComponentLink5Description: https://datasheet.ciiva.com/8896/pyu-rc0201-51-rohs-l-8-8896174.pdf?src-supplier=Avnet
R159 = Res_0402: Manufacturer: Yageo; Manufacturer Part Number 1: RC0201FR-07100KL; Part Description: 100 kOhms ±1% 0.05W, 1/20W Chip Resistor 0201 (0603 Metric) Moisture Resistant Thick Film; Resistance: 100kR; Power Rating: 50mW; Voltage Rating: 25V; Temperature Coefficient: 200ppm/°C; Value: 100k, 1%; ComponentLink1URL: https://datasheet.ciiva.com/7672/1563626-7672204.pdf?src-supplier=Element14; ComponentLink1Description: https://datasheet.ciiva.com/7672/1563626-7672204.pdf?src-supplier=Element14; ComponentLink2URL: https://datasheet.ciiva.com/22698/1563626-22698505.pdf?src-supplier=Element14; ComponentLink2Description: https://datasheet.ciiva.com/22698/1563626-22698505.pdf?src-supplier=Element14; ComponentLink3URL: https://datasheet.ciiva.com/29721/pyu-r-int-thick-7-29721196.pdf?src-supplier=Digi-Key; ComponentLink3Description: https://datasheet.ciiva.com/29721/pyu-r-int-thick-7-29721196.pdf?src-supplier=Digi-Key; ComponentLink4URL: https://datasheet.ciiva.com/29721/pyu-r-int-thick-7-29721195.pdf?src-supplier=Digi-Key; ComponentLink4Description: https://datasheet.ciiva.com/29721/pyu-r-int-thick-7-29721195.pdf?src-supplier=Digi-Key; ComponentLink5URL: https://datasheet.ciiva.com/8896/pyu-rc0201-51-rohs-l-8-8896174.pdf?src-supplier=Avnet; ComponentLink5Description: https://datasheet.ciiva.com/8896/pyu-rc0201-51-rohs-l-8-8896174.pdf?src-supplier=Avnet; Supplier 1: Digi-Key; Supplier Part Number 1: 311-100KMCT-ND; Stock 1: 6001055; Pricing 1: 1=0,10000, 10=0,03700, 100=0,01500, 1000=0,00672, 2500=0,00583, 5000=0,00482 (USD); RoHS: Yes; Case/Package: 0201; Number of Pins: 2; Case Code (Imperial): 0201; Case Code (Metric): 0603; Contact Plating: Tin,Matte; Size Code: 0201; Min Operating Temperature: -55°C; Max Operating Temperature: 125°C; Tolerance: 1%; Packaging: Tape and Reel; Package Quantity: 10000; Termination: SMD/SMT; Resistor Type: Thick Film; Number of Terminations: 2; Max Power Dissipation: 50mW; Voltage Rating (DC): 25V; Features: Moisture Resistant; Series: RC; Resistance Tolerance: 1%; Construction: Rectangular; Length: 0.024inch; Width: 0.012inch; Height: 0.01inch; Depth: 0.3mm; Reach SVHC Compliant: Yes; Military Standard: Not; Lead Free: Lead Free; RoHS Compliant: Yes; ComponentLink6URL: https://datasheet.ciiva.com/7660/1421516-7660806.pdf?src-supplier=Element14; ComponentLink6Description: https://datasheet.ciiva.com/7660/1421516-7660806.pdf?src-supplier=Element14; ComponentLink7URL: https://datasheet.ciiva.com/22698/1563626-22698495.pdf?src-supplier=Element14; ComponentLink7Description: https://datasheet.ciiva.com/22698/1563626-22698495.pdf?src-supplier=Element14; ComponentLink8URL: https://datasheet.ciiva.com/46391/1421516-46391338.pdf?src-supplier=Element14; ComponentLink8Description: https://datasheet.ciiva.com/46391/1421516-46391338.pdf?src-supplier=Element14; ComponentLink9URL: https://datasheet.ciiva.com/2493/pyu-r-int-thick-7-2493770.pdf?src-supplier=Digi-Key; ComponentLink9Description: https://datasheet.ciiva.com/2493/pyu-r-int-thick-7-2493770.pdf?src-supplier=Digi-Key; ComponentLink10URL: https://datasheet.ciiva.com/2493/pyu-r-int-thick-7-2493771.pdf?src-supplier=Digi-Key; ComponentLink10Description: https://datasheet.ciiva.com/2493/pyu-r-int-thick-7-2493771.pdf?src-supplier=Digi-Key; ComponentLink11URL: https://datasheet.ciiva.com/2493/pyu-r-int-thick-7-2493769.pdf?src-supplier=Digi-Key; ComponentLink11Description: https://datasheet.ciiva.com/2493/pyu-r-int-thick-7-2493769.pdf?src-supplier=Digi-Key; ComponentLink12URL: https://datasheet.ciiva.com/26829/getdatasheetpartid-420441-26829850.pdf?src-supplier=Verical; ComponentLink12Description: https://datasheet.ciiva.com/26829/getdatasheetpartid-420441-26829850.pdf?src-supplier=Verical
R160 = Res_0402: Manufacturer: Yageo; Manufacturer Part Number 1: RC0201FR-07100RL; Part Description: 100 Ohms ±1% 0.05W, 1/20W Chip Resistor 0201 (0603 Metric) Moisture Resistant Thick Film; Power Rating: 50mW; Voltage Rating: 25V; Temperature Coefficient: 200ppm/°C; ComponentLink1URL: http://www.yageo.com/documents/recent/PYu-RC_Group_51_RoHS_L_7.pdf; ComponentLink1Description: http://www.yageo.com/documents/recent/PYu-RC_Group_51_RoHS_L_7.pdf; Value: 100R, 1%; Supplier 1: Digi-Key; Supplier Part Number 1: 311-100MCT-ND; Stock 1: 1625377; Pricing 1: 1=0,10000, 10=0,03700, 100=0,01530, 1000=0,00685, 2500=0,00595, 5000=0,00491 (USD); RoHS: Yes; Case/Package: 0201; Case Code (Metric): 0603; Case Code (Imperial): 0201; Contact Plating: Tin,Matte; Size Code: 0201; Min Operating Temperature: -55°C; Max Operating Temperature: 125°C; Resistance: 100R; Tolerance: 1%; Packaging: Cut Tape; Package Quantity: 1; Resistor Type: Thick Film; Number of Terminations: 2; Termination: SMD/SMT; Max Power Dissipation: 50mW; Features: Moisture Resistant; Series: RC; Resistance Tolerance: 1%; Length: 0.024inch; Width: 0.012inch; Height: 0.01inch; Radiation Hardening: No; Lead Free: Lead Free; RoHS Compliant: Yes; ComponentLink2URL: https://datasheet.ciiva.com/2560/pyu-r-int-thick-7-2560866.pdf?src-supplier=Digi-Key; ComponentLink2Description: https://datasheet.ciiva.com/2560/pyu-r-int-thick-7-2560866.pdf?src-supplier=Digi-Key; ComponentLink3URL: https://datasheet.ciiva.com/2560/pyu-r-int-thick-7-2560867.pdf?src-supplier=Digi-Key; ComponentLink3Description: https://datasheet.ciiva.com/2560/pyu-r-int-thick-7-2560867.pdf?src-supplier=Digi-Key; ComponentLink4URL: https://datasheet.ciiva.com/2560/pyu-r-int-thick-7-2560865.pdf?src-supplier=Digi-Key; ComponentLink4Description: https://datasheet.ciiva.com/2560/pyu-r-int-thick-7-2560865.pdf?src-supplier=Digi-Key; ComponentLink5URL: https://datasheet.ciiva.com/8887/pyu-rc0201-51-rohs-l-8-8887865.pdf?src-supplier=Avnet; ComponentLink5Description: https://datasheet.ciiva.com/8887/pyu-rc0201-51-rohs-l-8-8887865.pdf?src-supplier=Avnet
R161 R167 R169 R188 R190 = Res_0402: Manufacturer: Yageo; Manufacturer Part Number 1: RC0201FR-0710KL; Part Description: 10 kOhms ±1% 0.05W, 1/20W Chip Resistor 0201 (0603 Metric) Moisture Resistant Thick Film; Resistance: 10kR; Power Rating: 50mW; Voltage Rating: 25V; Temperature Coefficient: 200ppm/°C; Value: 10k, 1%; ComponentLink1URL: https://datasheet.ciiva.com/5924/1563626-5924912.pdf?src-supplier=Farnell; ComponentLink1Description: https://datasheet.ciiva.com/5924/1563626-5924912.pdf?src-supplier=Farnell; ComponentLink2URL: https://datasheet.ciiva.com/22661/1563626-22661319.pdf?src-supplier=Element14; ComponentLink2Description: https://datasheet.ciiva.com/22661/1563626-22661319.pdf?src-supplier=Element14; Supplier 1: Digi-Key; Supplier Part Number 1: 311-10.0KMCT-ND; Stock 1: 17142315; Pricing 1: 1=0,10000, 10=0,03700, 100=0,01530, 1000=0,00685, 2500=0,00595, 5000=0,00491 (USD); RoHS: Yes; Case/Package: 0201; Number of Pins: 2; Case Code (Imperial): 0201; Case Code (Metric): 0603; Contact Plating: Tin,Matte; Weight: 6E-06oz; Min Operating Temperature: -55°C; Max Operating Temperature: 125°C; Tolerance: 1%; Packaging: Tape and Reel; Package Quantity: 10000; Termination: SMD/SMT; Resistor Type: Thick Film; Number of Terminations: 2; Max Power Dissipation: 50mW; Voltage Rating (DC): 25V; Features: Moisture Resistant; Series: RC; Resistance Tolerance: 1%; Construction: Rectangular; Working Voltage: 25V; Technology: THICK FILM; Length: 0.6mm; Width: 0.012inch; Height: 0.01inch; Depth: 0.3mm; Radiation Hardening: No; Reach SVHC Compliant: Yes; Military Standard: Not; Lead Free: Lead Free; RoHS Compliant: Yes; ComponentLink3URL: https://datasheet.ciiva.com/7660/1421516-7660807.pdf?src-supplier=Element14; ComponentLink3Description: https://datasheet.ciiva.com/7660/1421516-7660807.pdf?src-supplier=Element14; ComponentLink4URL: https://datasheet.ciiva.com/46391/1421516-46391339.pdf?src-supplier=Element14; ComponentLink4Description: https://datasheet.ciiva.com/46391/1421516-46391339.pdf?src-supplier=Element14; ComponentLink5URL: https://datasheet.ciiva.com/2467/pyu-r-int-thick-7-2467110.pdf?src-supplier=Digi-Key; ComponentLink5Description: https://datasheet.ciiva.com/2467/pyu-r-int-thick-7-2467110.pdf?src-supplier=Digi-Key; ComponentLink6URL: https://datasheet.ciiva.com/2467/pyu-r-int-thick-7-2467111.pdf?src-supplier=Digi-Key; ComponentLink6Description: https://datasheet.ciiva.com/2467/pyu-r-int-thick-7-2467111.pdf?src-supplier=Digi-Key; ComponentLink7URL: https://datasheet.ciiva.com/2467/pyu-r-int-thick-7-2467109.pdf?src-supplier=Digi-Key; ComponentLink7Description: https://datasheet.ciiva.com/2467/pyu-r-int-thick-7-2467109.pdf?src-supplier=Digi-Key
R173 = Res_0402: Part Description: 3 kOhms ±1% 0.05W, 1/20W Chip Resistor 0201 (0603 Metric) Moisture Resistant Thick Film; Manufacturer: Yageo; Manufacturer Part Number 1: RC0201FR-073KL; Resistance: 3kR; Max Power Dissipation: 50mW; Temperature Coefficient: 200ppm/°C; Value: 3k, 1%; Supplier 1: Digi-Key; Supplier Part Number 1: YAG2656CT-ND; Stock 1: 269780; Pricing 1: 1=0,10000, 10=0,03700, 100=0,01530, 1000=0,00685, 2500=0,00595, 5000=0,00491 (USD); RoHS: Yes; Case/Package: 0201; Case Code (Metric): 0603; Case Code (Imperial): 0201; Min Operating Temperature: -55°C; Max Operating Temperature: 125°C; Packaging: Tape and Reel; Resistor Type: Thick Film; Number of Terminations: 2; Tolerance: 1%; Features: Moisture Resistant; Length: 0.024inch; Width: 0.012inch; Height: 0.01inch; RoHS Compliant: Yes; ComponentLink1URL: http://www.yageo.com/documents/recent/PYu-RC_Group_51_RoHS_L_10.pdf?src-supplier=Digi-Key; ComponentLink1Description: http://www.yageo.com/documents/recent/PYu-RC_Group_51_RoHS_L_10.pdf?src-supplier=Digi-Key; ComponentLink2URL: http://www.yageo.com.tw/exep/pages/download/literatures/PYu-R_INT-thick_7.pdf?src-supplier=Digi-Key; ComponentLink2Description: http://www.yageo.com.tw/exep/pages/download/literatures/PYu-R_INT-thick_7.pdf?src-supplier=Digi-Key; ComponentLink3URL: http://www.yageo.com/documents/recent/PYu-RC_Group_51_RoHS_L_9.pdf?src-supplier=Digi-Key; ComponentLink3Description: http://www.yageo.com/documents/recent/PYu-RC_Group_51_RoHS_L_9.pdf?src-supplier=Digi-Key
R174 = Res_0402: Manufacturer: Yageo; Manufacturer Part Number 1: RC0201FR-0712K7L; Part Description: 12.7 kOhms ±1% 0.05W, 1/20W Chip Resistor 0201 (0603 Metric) Moisture Resistant Thick Film; Resistance: 12.7kR; Temperature Coefficient: 200ppm/°C; Max Power Dissipation: 50mW; Value: 12.7k, 1%; ComponentLink1URL: https://datasheet.ciiva.com/5924/1563626-5924912.pdf?src-supplier=Farnell; ComponentLink1Description: https://datasheet.ciiva.com/5924/1563626-5924912.pdf?src-supplier=Farnell; ComponentLink2URL: https://datasheet.ciiva.com/22661/1563626-22661319.pdf?src-supplier=Element14; ComponentLink2Description: https://datasheet.ciiva.com/22661/1563626-22661319.pdf?src-supplier=Element14; ComponentLink3URL: https://datasheet.ciiva.com/7660/1421516-7660807.pdf?src-supplier=Element14; ComponentLink3Description: https://datasheet.ciiva.com/7660/1421516-7660807.pdf?src-supplier=Element14; ComponentLink4URL: https://datasheet.ciiva.com/46391/1421516-46391339.pdf?src-supplier=Element14; ComponentLink4Description: https://datasheet.ciiva.com/46391/1421516-46391339.pdf?src-supplier=Element14; ComponentLink5URL: https://datasheet.ciiva.com/2467/pyu-r-int-thick-7-2467110.pdf?src-supplier=Digi-Key; ComponentLink5Description: https://datasheet.ciiva.com/2467/pyu-r-int-thick-7-2467110.pdf?src-supplier=Digi-Key; ComponentLink6URL: https://datasheet.ciiva.com/2467/pyu-r-int-thick-7-2467111.pdf?src-supplier=Digi-Key; ComponentLink6Description: https://datasheet.ciiva.com/2467/pyu-r-int-thick-7-2467111.pdf?src-supplier=Digi-Key; ComponentLink7URL: https://datasheet.ciiva.com/2467/pyu-r-int-thick-7-2467109.pdf?src-supplier=Digi-Key; ComponentLink7Description: https://datasheet.ciiva.com/2467/pyu-r-int-thick-7-2467109.pdf?src-supplier=Digi-Key; Supplier 1: Digi-Key; Supplier Part Number 1: 311-12.7KMCT-ND; Stock 1: 49027; Pricing 1: 1=0,10000, 10=0,03700, 100=0,01500, 1000=0,00672, 2500=0,00583, 5000=0,00482 (USD); RoHS: Yes; Case/Package: 0201; Case Code (Metric): 0603; Case Code (Imperial): 0201; Min Operating Temperature: -55°C; Max Operating Temperature: 125°C; Package Quantity: 1; Tolerance: 1%; Packaging: Tape and Reel; Resistor Type: Thick Film; Number of Terminations: 2; Features: Moisture Resistant; Series: RC; Length: 0.024inch; Width: 0.012inch; Height: 0.01inch; RoHS Compliant: Yes; ComponentLink8URL: https://datasheet.ciiva.com/2493/pyu-r-int-thick-7-2493806.pdf?src-supplier=Digi-Key; ComponentLink8Description: https://datasheet.ciiva.com/2493/pyu-r-int-thick-7-2493806.pdf?src-supplier=Digi-Key; ComponentLink9URL: https://datasheet.ciiva.com/2493/pyu-r-int-thick-7-2493807.pdf?src-supplier=Digi-Key; ComponentLink9Description: https://datasheet.ciiva.com/2493/pyu-r-int-thick-7-2493807.pdf?src-supplier=Digi-Key; ComponentLink10URL: https://datasheet.ciiva.com/2493/pyu-r-int-thick-7-2493805.pdf?src-supplier=Digi-Key; ComponentLink10Description: https://datasheet.ciiva.com/2493/pyu-r-int-thick-7-2493805.pdf?src-supplier=Digi-Key
R176 R182 R185 R192 R194 R195 = Res_0402: Manufacturer: Yageo; Manufacturer Part Number 1: RC0201FR-0747RL; Part Description: 47 Ohms ±1% 0.05W, 1/20W Chip Resistor 0201 (0603 Metric) Moisture Resistant Thick Film; Power Rating: 50mW; Voltage Rating: 25V; Temperature Coefficient: 200ppm/°C; Value: 47R, 1%; Supplier 1: Digi-Key; Supplier Part Number 1: YAG2694CT-ND; Stock 1: 778022; Pricing 1: 1=0,10000, 10=0,03700, 100=0,01530, 1000=0,00685, 2500=0,00595, 5000=0,00491 (USD); RoHS: Yes; Case/Package: 0201; Case Code (Imperial): 0201; Case Code (Metric): 0603; Min Operating Temperature: -55°C; Max Operating Temperature: 125°C; Packaging: Tape and Reel; Resistance: 47R; Tolerance: 1%; Resistor Type: Thick Film; Termination: SMD/SMT; Number of Terminations: 2; Max Power Dissipation: 50mW; Features: Moisture Resistant; Series: RC; Resistance Tolerance: 1%; Length: 0.6mm; Width: 0.3mm; Height: 0.23mm; Reach SVHC Compliant: Yes; RoHS Compliant: Yes; ComponentLink1URL: https://datasheet.ciiva.com/5924/1563626-5924912.pdf?src-supplier=Farnell; ComponentLink1Description: https://datasheet.ciiva.com/5924/1563626-5924912.pdf?src-supplier=Farnell; ComponentLink2URL: https://datasheet.ciiva.com/22661/1563626-22661319.pdf?src-supplier=Element14; ComponentLink2Description: https://datasheet.ciiva.com/22661/1563626-22661319.pdf?src-supplier=Element14
R179 = Res_0402: Manufacturer: Panasonic Electronic Components; Part Description: RES SMD 10 OHM 1% 1/20W 0201; Manufacturer Part Number 1: ERJ-1GEF10R0C; Power (Watts): 0.05W, 1/20W; Resistance (Ohms): 10; Temperature Coefficient: ±200ppm/°C; Value: 10R, 1%; Supplier 1: Digi-Key; Supplier Part Number 1: P10.0ABCT-ND; Package / Case: 0201 (0603 Metric); Height: 0.010" (0.26mm); Supplier Device Package: 0201; Packaging: Cut Tape (CT); Composition: Thick Film; Category: Resistors; Tolerance: ±1%; Number of Terminations: 2; Size / Dimension: 0.024" L x 0.012" W (0.60mm x 0.30mm); Operating Temperature: -55°C ~ 125°C; Features: -; RoHS: RoHS Compliant
R184 = Res_0402: Part Description: 470 Ohms ±1% 0.05W, 1/20W Chip Resistor 0201 (0603 Metric) Moisture Resistant Thick Film; Manufacturer: Yageo; Manufacturer Part Number 1: RC0201FR-07470RL; Voltage Rating (DC): 25V; Value: 470, 1%; ComponentLink1URL: https://datasheet.ciiva.com/8944/crcw0201e3-8944937.pdf?src-supplier=Avnet; ComponentLink1Description: https://datasheet.ciiva.com/8944/crcw0201e3-8944937.pdf?src-supplier=Avnet; ComponentLink2URL: https://datasheet.ciiva.com/2473/crcw0201e3-2473436.pdf?src-supplier=Digi-Key; ComponentLink2Description: https://datasheet.ciiva.com/2473/crcw0201e3-2473436.pdf?src-supplier=Digi-Key; ComponentLink3URL: https://datasheet.ciiva.com/2473/crcw0201e3-2473437.pdf?src-supplier=Digi-Key; ComponentLink3Description: https://datasheet.ciiva.com/2473/crcw0201e3-2473437.pdf?src-supplier=Digi-Key; ComponentLink4URL: https://datasheet.ciiva.com/2473/crcw0201e3-2473438.pdf?src-supplier=Digi-Key; ComponentLink4Description: https://datasheet.ciiva.com/2473/crcw0201e3-2473438.pdf?src-supplier=Digi-Key; ComponentLink5URL: https://datasheet.ciiva.com/16394/dcrcwe3-16394575.pdf?src-supplier=Future+Electronics; ComponentLink5Description: https://datasheet.ciiva.com/16394/dcrcwe3-16394575.pdf?src-supplier=Future+Electronics; Supplier 1: Digi-Key; Supplier Part Number 1: YAG2689CT-ND; Stock 1: 296760; Pricing 1: 1=0,1, 10=0,027, 50=0,0172, 100=0,0143, 500=0,00988, 1000=0,00854, 5000=0,00629 (USD); RoHS: Yes; ComponentLink6URL: https://datasheet.ciiva.com/7672/1563626-7672231.pdf?src-supplier=Element14; ComponentLink6Description: https://datasheet.ciiva.com/7672/1563626-7672231.pdf?src-supplier=Element14; ComponentLink7URL: https://datasheet.ciiva.com/22698/1563626-22698527.pdf?src-supplier=Element14; ComponentLink7Description: https://datasheet.ciiva.com/22698/1563626-22698527.pdf?src-supplier=Element14
R189 = Res_0402: Part Description: 330 Ohms ±1% 0.05W, 1/20W Chip Resistor 0201 (0603 Metric) Thick Film; Manufacturer: Vishay Dale; Manufacturer Part Number 1: CRCW0201330RFKED; Power Rating: 50mW; Voltage Rating: 30V; Temperature Coefficient: 100ppm/°C; Value: 330R, 1%; Supplier 1: Digi-Key; Supplier Part Number 1: 541-330AABCT-ND; Stock 1: 245078; Pricing 1: 1=0,27000, 10=0,23000, 100=0,08990, 1000=0,03762, 2500=0,03448, 5000=0,03135 (USD); RoHS: Yes; Case/Package: 0201; Weight: 6E-06oz; Case Code (Imperial): 0201; Case Code (Metric): 0603; Contact Plating: Tin; Size Code: 0201; Min Operating Temperature: -55°C; Max Operating Temperature: 155°C; Resistance: 330R; Tolerance: 1%; Packaging: Tape and Reel; Package Quantity: 1; Resistor Type: Thick Film; Number of Terminations: 2; Max Power Dissipation: 50mW; Series: CRCW; Construction: Rectangular; Length: 0.6mm; Width: 0.3mm; Height: 0.011inch; Depth: 0.3mm; Radiation Hardening: No; Military Standard: Not; Lead Free: Lead Free; RoHS Compliant: Yes; ComponentLink1URL: https://datasheet.ciiva.com/8944/crcw0201e3-8944937.pdf?src-supplier=Avnet; ComponentLink1Description: https://datasheet.ciiva.com/8944/crcw0201e3-8944937.pdf?src-supplier=Avnet; ComponentLink2URL: https://datasheet.ciiva.com/2473/crcw0201e3-2473436.pdf?src-supplier=Digi-Key; ComponentLink2Description: https://datasheet.ciiva.com/2473/crcw0201e3-2473436.pdf?src-supplier=Digi-Key; ComponentLink3URL: https://datasheet.ciiva.com/2473/crcw0201e3-2473437.pdf?src-supplier=Digi-Key; ComponentLink3Description: https://datasheet.ciiva.com/2473/crcw0201e3-2473437.pdf?src-supplier=Digi-Key; ComponentLink4URL: https://datasheet.ciiva.com/2473/crcw0201e3-2473438.pdf?src-supplier=Digi-Key; ComponentLink4Description: https://datasheet.ciiva.com/2473/crcw0201e3-2473438.pdf?src-supplier=Digi-Key; ComponentLink5URL: https://datasheet.ciiva.com/16394/dcrcwe3-16394575.pdf?src-supplier=Future+Electronics; ComponentLink5Description: https://datasheet.ciiva.com/16394/dcrcwe3-16394575.pdf?src-supplier=Future+Electronics
XO1 = RPT7050A: Part Description: TCXO 30.72MHz, E6245LF; Manufacturer: Rakon; Manufacturer Part Number 1: E6245LF; Supplier 1: Rakon; Supplier Part Number 1: E6245LF
XO2 = TXCO: Part Description: TCXO 30.72MHz, E5280LF; Manufacturer: Rakon; Manufacturer Part Number 1: E5280LF; Supplier 1: Rakon; Supplier Part Number 1: E5280LF